# EAGLE design nRF52-AvmBeacon23cmMonopole (EAGLE 9.6.2)
Assembly variants: BomList
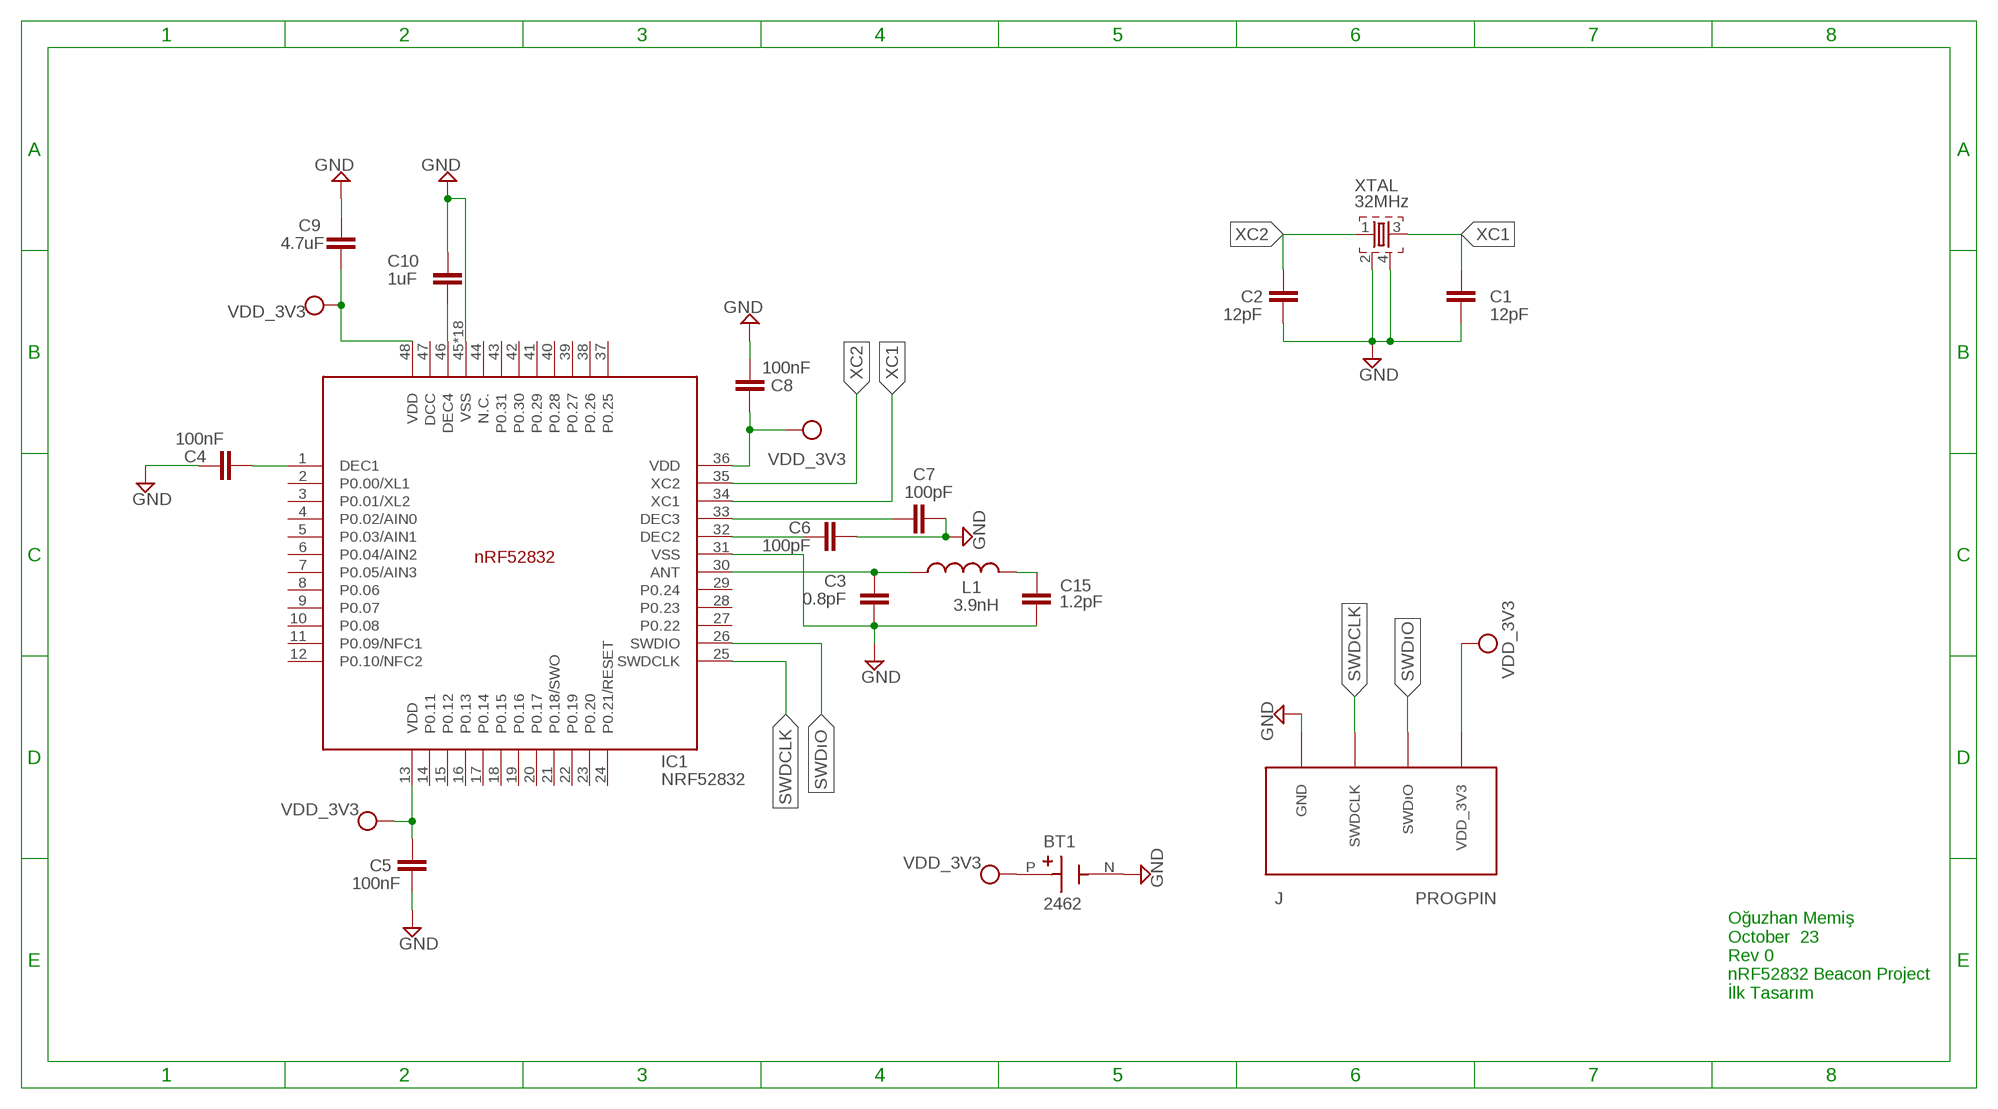
[diagram p0: schematic, sheet 1]

## Parts
BT1  2462  [BAT_2462]
C1  12pF  CAPACITOR_0402_N  [RESC0402_N]
C2  12pF  CAPACITOR_0402_N  [RESC0402_N]
C3  0.8pF  CAPACITOR_0402_N  [RESC0402_N]
C4  100nF  CAPACITOR_0402_N  [RESC0402_N]
C5  100nF  CAPACITOR_0402_N  [RESC0402_N]
C6  100pF  CAPACITOR_0402_N  [RESC0402_N]
C7  100pF  CAPACITOR_0402_N  [RESC0402_N]
C8  100nF  CAPACITOR_0402_N  [RESC0402_N]
C9  4.7uF  CAPACITOR_0603_N  [RESC0603_N]
C10  1uF  CAPACITOR_0603_N  [RESC0603_N]
C15  1.2pF  CAPACITOR_0402_N  [RESC0402_N]
IC1  NRF52832  [QFN40P600X600X90-48_N]
L1  3.9nH  INDUCTOR_0402_N  [RESC0402_N]
U$1  PROGPIN4*2.54  [PROGPIN]  (not fitted in variant BomList)
XTAL  32MHz  XTAL_32MHZ  [BT-XTAL_2016_N]

## Nets
GND: BT1.N(NEG) C1.2 C2.2 C3.1 C4.1 C5.2 C6.2 C7.2 C8.2 C9.1 C10.1 C15.2 IC1.31(VSS) IC1.45(VSS) IC1.PAD(VSS) IC1.PAD@VIA01(VSS) IC1.PAD@VIA02(VSS) IC1.PAD@VIA03(VSS) IC1.PAD@VIA04(VSS) IC1.PAD@VIA05(VSS) IC1.PAD@VIA06(VSS) IC1.PAD@VIA07(VSS) IC1.PAD@VIA08(VSS) IC1.PAD@VIA09(VSS) IC1.PAD@VIA10(VSS) IC1.PAD@VIA11(VSS) IC1.PAD@VIA12(VSS) IC1.PAD@VIA13(VSS) IC1.PAD@VIA14(VSS) IC1.PAD@VIA15(VSS) IC1.PAD@VIA16(VSS) U$1.GND XTAL.2 XTAL.4
N$1: C4.2 IC1.1(DEC1)
N$2: C3.2 IC1.30(ANT) L1.1
N$4: C6.1 IC1.32(DEC2)
N$5: C7.1 IC1.33(DEC3)
N$6: C10.2 IC1.46(DEC4)
SWDCLK: IC1.25(SWDCLK) U$1.SWDCLK
SWDıO: IC1.26(SWDIO) U$1.SWDIO(SWDıO)
TL: C15.1 L1.2
VDD: BT1.P(POS) C5.1 C8.1 C9.2 IC1.13(VDD) IC1.36(VDD) IC1.48(VDD) U$1.VDD_3V3
XC1: C1.1 IC1.34(XC1) XTAL.3
XC2: C2.1 IC1.35(XC2) XTAL.1
Unconnected: IC1.2(P0.00/XL1) IC1.3(P0.01/XL2) IC1.4(P0.02/AIN0) IC1.5(P0.03/AIN1) IC1.6(P0.04/AIN2) IC1.7(P0.05/AIN3) IC1.8(P0.06) IC1.9(P0.07) IC1.10(P0.08) IC1.11(P0.09/NFC1) IC1.12(P0.10/NFC2) IC1.14(P0.11) IC1.15(P0.12) IC1.16(P0.13) IC1.17(P0.14) IC1.18(P0.15) IC1.19(P0.16) IC1.20(P0.17) IC1.21(P0.18/SWO) IC1.22(P0.19) IC1.23(P0.20) IC1.24(P0.21/RESET) IC1.27(P0.22) IC1.28(P0.23) IC1.29(P0.24) IC1.37(P0.25) IC1.38(P0.26) IC1.39(P0.27) IC1.40(P0.28) IC1.41(P0.29) IC1.42(P0.30) IC1.43(P0.31) IC1.44(N.C.) IC1.47(DCC)

## Notes on the sheet
- Oğuzhan Memiş
  October  23
  Rev 0 
  nRF52832 Beacon Project
  İlk Tasarım

## Library data of the parts
BT1 = 2462:2462: Check availability <https://pricing.snapeda.com/parts/2462/Keystone/view-part?ref=eda>; AVAILABILITY: In Stock; CHECK_PRICES: https://www.snapeda.com/parts/2462/Keystone+Electronics/view-part/?ref=eda; DESCRIPTION: Battery Holder, AA, Polypropylene, PC Mount, 2, Spring, PC Lug | Keystone Electronics 2462; MF: Keystone; MP: 2462; PACKAGE: None; PRICE: None; SNAPEDA_LINK: https://www.snapeda.com/parts/2462/Keystone+Electronics/view-part/?ref=snap
C1-C10 = Nordic_misc:CAPACITOR: Generic chip capacitor
C15 = Nordic_nRF:CAPACITOR: Generic chip capacitor
IC1 = Nordic_nRF:NRF52832: nRF52832 Features Single chip, highly flexible, 2.4 GHz multi-protocol SoC 32-bit ARM Cortex-M4F Processor 1.7v to 3.6v operation 512kB flash + 64kB RAM Supports concurrent Bluetooth Smart/ANT protocol operation On-chip NFC tag for Out-of-Band (OOB) pairing Up to +4dBm output power -96dBm sensitivity, Bluetooth Smart Thread safe and run-time protected Event driven API On air compatible with nRF24L and nRF24AP series 2 data rates (2Mbps/1Mbps) PPI - maximum flexibility for power-efficient applications and code simplification Automated power management system with automatic power management of each peripheral Configurable I/O mapping for analog and digital I/O 3 x Master/Slave SPI 2 x Two-wire interface (I²C) UART (RTS/CTS) 3 x PWM AES HW encryption Real Time Counter (RTC) Digital microphone interface (PDM) On-chip balun Applications Internet of Things (IoT) Wearables SmartHome sensors Connected white goods Computer peripherals Voice-command smart remotes A4WP ‘Rezence’ wireless charging Beacons Sports and fitness sensors and hubs Connected health products Smart watches RC Toys Interactive games Building automation and sensor networks
L1 = Nordic_misc:INDUCTOR: Generic chip inductor
U$1 = 2023Poi:PROGPIN
XTAL = Nordic_nRF:XTAL_32MHZ

## Board
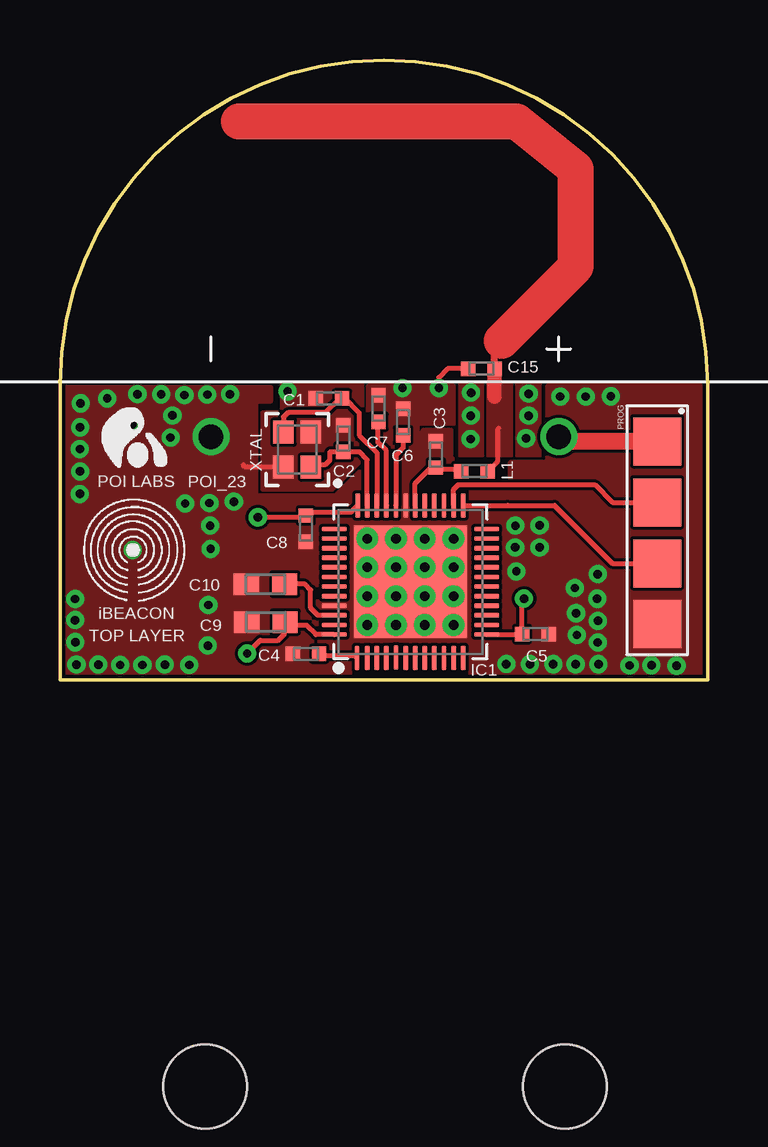
[diagram p1: board, top side]
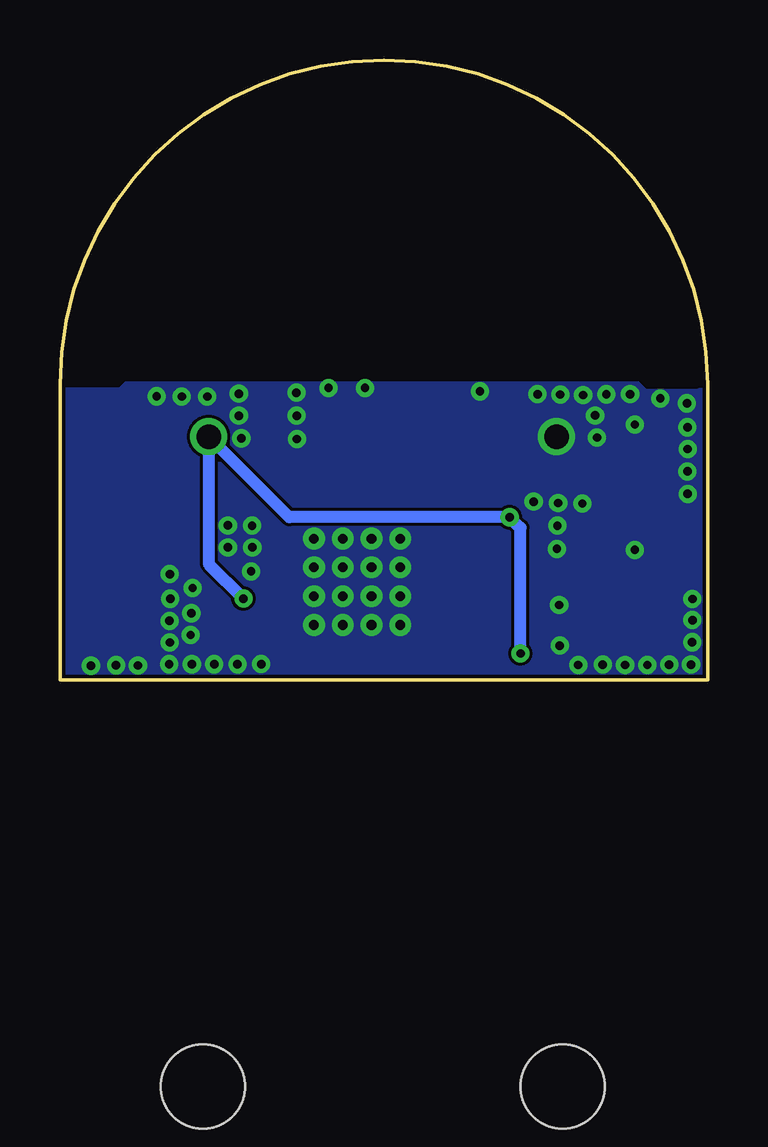
[diagram p2: board, bottom side, seen from below]

Size 27 x 25.85 mm. Coordinates in mm from the lower left corner, seen from the top.
Outline: 0,0 0,12.35 arc-180 27,12.35 27,0 0,0
Copper layers (1*16): Top 0.0035mm / dielectric 1.5mm / Bottom 0.0035mm
Design rules "default *": minimum track width 0.2mm, minimum drill 0.35mm, track to track 0.13mm, track to pad 6mil, pad to pad 6mil, via to via 6mil, smd to smd 0.14mm, copper to edge 0.14mm, drill to drill 6mil, minimum pad ring 10mil, minimum via ring 8mil, stop-mask expansion 4mil, vias tented up to drill 0mil, thermal gap 10mil

### Footprints (pad centres in the part's own frame; a part is rotated, then mirrored left to right if it is on the bottom)
BAT_2462 = drill 1.02: N 27.1,7.25; P 27.1,-7.25 | hole 3.5: 0,7.5; 0,-7.5
RESC0402_N = smd 0.6 x 0.6: 1 -0.55,0; 2 0.55,0
RESC0603_N = smd 1.05 x 0.9: 1 -0.8,0; 2 0.8,0
QFN40P600X600X90-48_N = smd 1.031 x 0.2: 1 -3.178,2.225; 2 -3.178,1.8; 3 -3.178,1.4; 4 -3.178,1; 5 -3.152,0.6; 6 -3.178,0.2; 7 -3.178,-0.2; 8 -3.178,-0.6; 9 -3.178,-1; 10 -3.178,-1.4; 11 -3.178,-1.8; 12 -3.178,-2.2; 25 3.178,-2.2; 26 3.178,-1.8; 27 3.178,-1.4; 28 3.178,-1; 29 3.178,-0.6; 30 3.178,-0.2; 31 3.178,0.2; 32 3.178,0.6; 33 3.178,1; 34 3.178,1.4; 35 3.178,1.8; 36 3.178,2.2 | smd 0.2 x 1.031: 13 -2.2,-3.178; 14 -1.8,-3.178; 15 -1.4,-3.178; 16 -1,-3.178; 17 -0.6,-3.178; 18 -0.2,-3.178; 19 0.2,-3.178; 20 0.6,-3.178; 21 1,-3.178; 22 1.4,-3.178; 23 1.8,-3.178; 24 2.2,-3.178; 37 2.2,3.178; 38 1.8,3.178; 39 1.4,3.178; 40 1,3.178; 41 0.6,3.178; 42 0.2,3.178; 43 -0.2,3.178; 44 -0.6,3.178; 45 -1,3.178; 46 -1.4,3.178; 47 -1.8,3.178; 48 -2.2,3.178 | smd 4.7 x 4.7: PAD 0,0 | drill 0.4: PAD@VIA01 -1.8,1.8; PAD@VIA02 -1.8,0.6; PAD@VIA03 -1.8,-0.6; PAD@VIA04 -1.8,-1.8; PAD@VIA05 -0.6,1.8; PAD@VIA06 -0.6,0.6; PAD@VIA07 -0.6,-0.6; PAD@VIA08 -0.6,-1.8; PAD@VIA09 0.6,1.8; PAD@VIA10 0.6,0.6; PAD@VIA11 0.6,-0.6; PAD@VIA12 0.6,-1.8; PAD@VIA13 1.8,1.8; PAD@VIA14 1.8,0.6; PAD@VIA15 1.8,-0.6; PAD@VIA16 1.8,-1.8
PROGPIN = smd 2 x 2: GND 7.62,0; SWDCLK 5.08,0; SWDIO 2.54,0; VDD_3V3 0,0
BT-XTAL_2016_N = smd 0.95 x 0.85: 1 -0.725,-0.575; 2 0.725,-0.575; 3 0.725,0.575; 4 -0.725,0.575

### Placement (x,y rotation side)
BT1  13.55,-16.95 90 top
C1  11.21,11.74 180 top
C2  11.82,10.07 90 top
C3  15.67,9.41 270 top
C4  10.25,1.1 0 top
C5  19.82,1.92 0 top
C6  14.31,10.76 90 top
C7  13.28,11.32 90 top
C8  10.25,6.31 270 top
C9  8.59,2.42 0 top
C10  8.57,4 0 top
C15  17.57,12.98 180 top
IC1  14.61,4.1 90 top
L1  17.28,8.71 0 top
U$1  24.9,9.95 270 top
U$2  [POILOGO]  2.45,8.85 0 top
U$3  [IBEACON]  2.75,5.4 0 top
XTAL  9.89,9.61 90 top

### Tracks (layer width: path | path; a pad name or v marks a point on that pad's centre or on a via)
GND  (via drill 0.35)
  Top 0.2: XTAL.4 7.72,8.88 7.64,8.97 | C15.2 16.16,12.98 15.8,12.62 v15.8,12.18
  other vias: 17.14,11.98 17.13,11.02 17.12,10.05 19.54,11.94 19.54,11.02 19.44,10.08 14.28,12.18 0.86,11.54 0.84,10.54 0.83,9.63 0.84,8.7 0.83,7.76 1.97,11.74 3.23,11.92 4.22,11.91 5.19,11.88 6.14,11.9 7.09,11.92 4.69,11.03 4.61,10.11 5.22,7.36 6.23,7.38 7.25,7.44 6.26,6.44 6.28,5.47 3.03,5.43 0.63,3.38 0.63,2.5 0.64,1.58 0.69,0.65 1.6,0.65 2.51,0.63 3.44,0.63 4.37,0.65 5.39,0.63 6.16,1.44 6.19,3.13 18.99,6.44 20,6.45 20,5.53 18.98,5.53 19.03,4.53 22.42,4.42 21.47,3.84 22.4,3.39 21.52,2.79 22.43,2.47 22.42,1.57 21.55,1.88 22.45,0.66 23.75,0.61 24.66,0.62 25.71,0.6 21.5,0.66 20.57,0.66 19.6,0.66 18.61,0.67 9.49,12.04 3.03,10.65 20.86,11.82 21.92,11.82 22.97,11.83
  pour Top (no thermals): 9.25,12.31 9.25,11.14 8.45,11.14 8.45,7.96 11.34,7.96 12.59,9.21 12.59,12.31
  pour Top (no thermals): 16.66,12.35 16.66,9.35 17.63,9.35 17.63,12.35
  pour Top: 19.04,12.35 19.04,9.35 20.04,9.35 20.04,12.35
  pour Top (no thermals): 0.09,12.21 8.76,12.22 8.78,12.23 8.78,11.63 8.76,11.61 8.17,11.61 8.16,11.6 8.16,7.71 8.18,7.69 11.51,7.69 12.87,9.05 12.87,12.27 16.39,12.27 16.39,10.71 16.41,10.69 14.93,10.69 14.89,10.65 14.89,8.08 18.43,8.08 18.79,8.44 18.79,9.08 20.25,9.08 20.35,9.18 20.35,12.28 26.88,12.28 26.88,0.14 0.18,0.14 0.15,0.17 0.15,12.17 0.13,12.19
  pour Top (no thermals): 14.87,9.87 14.87,7.97 16.46,7.97 16.7,8.21 18.15,8.21 18.18,8.24 18.18,9.07 18.19,9.08 16.5,9.08 16.31,9.27 16.31,10.41 15.14,10.41
  pour Bottom (no thermals): 0.29,12.12 0.29,0.28 0.3,0.26 26.75,0.26 26.79,0.22 26.79,12.11 26.78,12.12 24.47,12.12 24.22,12.37 2.93,12.37 2.61,12.05 0.36,12.06 0.32,12.09
N$1
  Top 0.2: IC1.1 12.31,1 10.9,1 C4.2
N$2
  Top 0.2: L1.1 16.66,8.78 15.75,8.78 C3.2 | C3.2 15.67,8.69 | C3.2 15.47,8.86 14.81,8.2 IC1.30
N$4
  Top 0.2: C6.1 14.31,9.69 14.01,9.39 IC1.32
N$5
  Top 0.2: IC1.33 13.61,9.56 13.26,9.91 13.26,10.75 C7.1
N$6
  Top 0.2: IC1.46 10.76,2.7 10.45,3.01 10.45,3.76 10.21,4 C10.2
SWDCLK
  Top 0.2: U$1.SWDCLK 23.03,4.87 20.62,7.28 18.67,7.28 IC1.25
SWDıO
  Top 0.2: U$1.SWDIO 23.04,7.41 22.3,8.15 16.61,8.15 16.41,7.95 IC1.26
TL
  Top 0.2: L1.2 18.25,9.13 18.25,10.45 18.29,10.49 | 18.12,13.85 18.42,14.15
  Top 0.3: C15.1 18.12,13.85
  Top 0.6: C15.1 18.12,11.81
  Top 1.5: 18.42,14.15 21.51,17.24 21.51,21.3 19.05,23.28 7.45,23.28
  pour Top: 18.84,9.35 18.84,12.35 17.83,12.35 17.83,9.35 17.87,9.34 17.88,9.35
VDD  (via drill 0.35)
  Top 0.2: IC1.36 12.12,6.99 10.38,6.99 C8.1 10.18,6.79 v8.25,6.79 | IC1.13 19.25,1.9 C5.1 19.27,3.32 v19.35,3.4 | 9.36,2.28 9.33,2.31 | IC1.48 10.67,1.9 10.29,2.28 9.56,2.28 | 9.56,2.28 9.36,2.28 | v7.8,1.11 8.35,1.66 9.1,1.66 9.36,1.92 9.36,2.28 | 9.36,2.28 9.39,2.31 C9.2 9.42,2.42 9.56,2.28
  Top 0.7: 24.7,10.15 U$1.VDD_3V3 21,9.95 BT1.P
  Bottom 0.5: v7.8,1.11 7.8,6.34 v8.25,6.79 17.44,6.79 BT1.P 20.8,4.85 v19.35,3.4
XC1
  Top 0.2: IC1.34 13.21,9.48 12.47,10.22 12.47,11.14 11.82,11.79 C1.1 11.67,11.74 11.08,11.15 9.5,11.15 9.32,10.96 XTAL.3
XC2
  Top 0.2: 10.54,8.96 XTAL.1 10.57,8.99 11.07,8.99 11.25,9.17 11.25,9.49 11.28,9.52 C2.1 12.48,9.52 12.81,9.19 IC1.35

### Text on the board
tNames: C15 | POI LABS | POI_23 | iBEACON | TOP LAYER